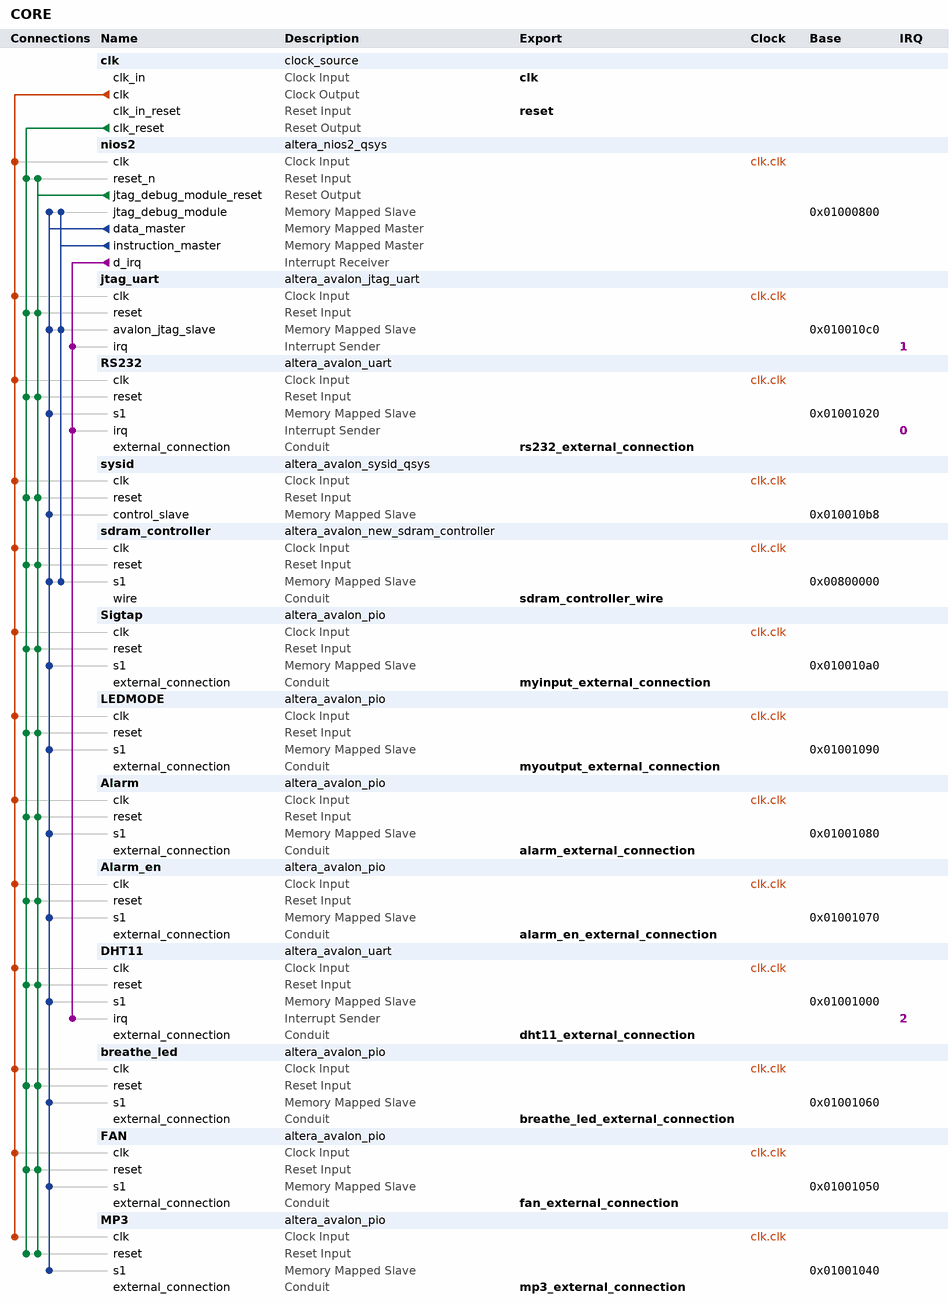
[diagram p0: system contents]
# Platform Designer (Qsys) system CORE, Cyclone II EP2C35F672C6
# Parameters at their usual value, and those the tool derives, are not listed.
package require -exact qsys 13.0.1
create_system CORE
set_project_property DEVICE_FAMILY {Cyclone II}
set_project_property DEVICE EP2C35F672C6

add_instance clk clock_source 13.0
set_instance_parameter_value clk clockFrequency 100000000

add_instance nios2 altera_nios2_qsys 13.0
set_instance_parameter_value nios2 resetSlave sdram_controller.s1
set_instance_parameter_value nios2 mmu_TLBMissExcSlave None
set_instance_parameter_value nios2 exceptionSlave sdram_controller.s1
set_instance_parameter_value nios2 breakSlave nios2.jtag_debug_module
set_instance_parameter_value nios2 impl Fast
set_instance_parameter_value nios2 icache_size 4096

add_instance jtag_uart altera_avalon_jtag_uart 13.0.1
set_instance_parameter_value jtag_uart simInteractiveOptions NO_INTERACTIVE_WINDOWS

add_instance RS232 altera_avalon_uart 13.0.1
set_instance_parameter_value RS232 baud 115200
set_instance_parameter_value RS232 dataBits 8
set_instance_parameter_value RS232 fixedBaud true
set_instance_parameter_value RS232 parity NONE
set_instance_parameter_value RS232 stopBits 1

add_instance sysid altera_avalon_sysid_qsys 13.0
set_instance_parameter_value sysid id 0

add_instance sdram_controller altera_avalon_new_sdram_controller 13.0.1
set_instance_parameter_value sdram_controller TAC 5.5
set_instance_parameter_value sdram_controller TRCD 20.0
set_instance_parameter_value sdram_controller TRP 20.0
set_instance_parameter_value sdram_controller casLatency 3
set_instance_parameter_value sdram_controller columnWidth 8
set_instance_parameter_value sdram_controller dataWidth 16
set_instance_parameter_value sdram_controller generateSimulationModel false
set_instance_parameter_value sdram_controller model single_Micron_MT48LC4M32B2_7_chip
set_instance_parameter_value sdram_controller numberOfBanks 4
set_instance_parameter_value sdram_controller numberOfChipSelects 1
set_instance_parameter_value sdram_controller powerUpDelay 100.0
set_instance_parameter_value sdram_controller refreshPeriod 15.625
set_instance_parameter_value sdram_controller rowWidth 12

add_instance Sigtap altera_avalon_pio 13.0.1
set_instance_parameter_value Sigtap direction Input
set_instance_parameter_value Sigtap width 1

add_instance LEDMODE altera_avalon_pio 13.0.1
set_instance_parameter_value LEDMODE direction Output
set_instance_parameter_value LEDMODE width 2

add_instance Alarm altera_avalon_pio 13.0.1
set_instance_parameter_value Alarm direction Input
set_instance_parameter_value Alarm width 1

add_instance Alarm_en altera_avalon_pio 13.0.1
set_instance_parameter_value Alarm_en direction Input
set_instance_parameter_value Alarm_en width 1

add_instance DHT11 altera_avalon_uart 13.0.1
set_instance_parameter_value DHT11 baud 115200
set_instance_parameter_value DHT11 dataBits 8
set_instance_parameter_value DHT11 fixedBaud true
set_instance_parameter_value DHT11 parity NONE
set_instance_parameter_value DHT11 stopBits 1

add_instance breathe_led altera_avalon_pio 13.0.1
set_instance_parameter_value breathe_led direction Output
set_instance_parameter_value breathe_led width 1

add_instance FAN altera_avalon_pio 13.0.1
set_instance_parameter_value FAN direction Output
set_instance_parameter_value FAN resetValue 1
set_instance_parameter_value FAN width 1

add_instance MP3 altera_avalon_pio 13.0.1
set_instance_parameter_value MP3 direction Output
set_instance_parameter_value MP3 resetValue 1
set_instance_parameter_value MP3 width 1

# connections
add_connection clk.clk Alarm.clk clock
add_connection clk.clk Alarm_en.clk clock
add_connection clk.clk breathe_led.clk clock
add_connection clk.clk DHT11.clk clock
add_connection clk.clk FAN.clk clock
add_connection clk.clk jtag_uart.clk clock
add_connection clk.clk LEDMODE.clk clock
add_connection clk.clk MP3.clk clock
add_connection clk.clk nios2.clk clock
add_connection clk.clk RS232.clk clock
add_connection clk.clk sdram_controller.clk clock
add_connection clk.clk Sigtap.clk clock
add_connection clk.clk sysid.clk clock
add_connection clk.clk_reset Alarm.reset reset
add_connection clk.clk_reset Alarm_en.reset reset
add_connection clk.clk_reset breathe_led.reset reset
add_connection clk.clk_reset DHT11.reset reset
add_connection clk.clk_reset FAN.reset reset
add_connection clk.clk_reset jtag_uart.reset reset
add_connection clk.clk_reset LEDMODE.reset reset
add_connection clk.clk_reset MP3.reset reset
add_connection clk.clk_reset nios2.reset_n reset
add_connection clk.clk_reset RS232.reset reset
add_connection clk.clk_reset sdram_controller.reset reset
add_connection clk.clk_reset Sigtap.reset reset
add_connection clk.clk_reset sysid.reset reset
add_connection nios2.jtag_debug_module_reset Alarm.reset reset
add_connection nios2.jtag_debug_module_reset Alarm_en.reset reset
add_connection nios2.jtag_debug_module_reset breathe_led.reset reset
add_connection nios2.jtag_debug_module_reset DHT11.reset reset
add_connection nios2.jtag_debug_module_reset FAN.reset reset
add_connection nios2.jtag_debug_module_reset jtag_uart.reset reset
add_connection nios2.jtag_debug_module_reset LEDMODE.reset reset
add_connection nios2.jtag_debug_module_reset MP3.reset reset
add_connection nios2.jtag_debug_module_reset nios2.reset_n reset
add_connection nios2.jtag_debug_module_reset RS232.reset reset
add_connection nios2.jtag_debug_module_reset sdram_controller.reset reset
add_connection nios2.jtag_debug_module_reset Sigtap.reset reset
add_connection nios2.jtag_debug_module_reset sysid.reset reset
add_connection nios2.data_master Alarm.s1 avalon
set_connection_parameter_value nios2.data_master/Alarm.s1 baseAddress 0x01001080
add_connection nios2.data_master Alarm_en.s1 avalon
set_connection_parameter_value nios2.data_master/Alarm_en.s1 baseAddress 0x01001070
add_connection nios2.data_master breathe_led.s1 avalon
set_connection_parameter_value nios2.data_master/breathe_led.s1 baseAddress 0x01001060
add_connection nios2.data_master DHT11.s1 avalon
set_connection_parameter_value nios2.data_master/DHT11.s1 baseAddress 0x01001000
add_connection nios2.data_master FAN.s1 avalon
set_connection_parameter_value nios2.data_master/FAN.s1 baseAddress 0x01001050
add_connection nios2.data_master jtag_uart.avalon_jtag_slave avalon
set_connection_parameter_value nios2.data_master/jtag_uart.avalon_jtag_slave baseAddress 0x010010c0
add_connection nios2.data_master LEDMODE.s1 avalon
set_connection_parameter_value nios2.data_master/LEDMODE.s1 baseAddress 0x01001090
add_connection nios2.data_master MP3.s1 avalon
set_connection_parameter_value nios2.data_master/MP3.s1 baseAddress 0x01001040
add_connection nios2.data_master nios2.jtag_debug_module avalon
set_connection_parameter_value nios2.data_master/nios2.jtag_debug_module baseAddress 0x01000800
add_connection nios2.data_master RS232.s1 avalon
set_connection_parameter_value nios2.data_master/RS232.s1 baseAddress 0x01001020
add_connection nios2.data_master sdram_controller.s1 avalon
set_connection_parameter_value nios2.data_master/sdram_controller.s1 baseAddress 0x00800000
add_connection nios2.data_master Sigtap.s1 avalon
set_connection_parameter_value nios2.data_master/Sigtap.s1 baseAddress 0x010010a0
add_connection nios2.data_master sysid.control_slave avalon
set_connection_parameter_value nios2.data_master/sysid.control_slave baseAddress 0x010010b8
add_connection nios2.instruction_master jtag_uart.avalon_jtag_slave avalon
set_connection_parameter_value nios2.instruction_master/jtag_uart.avalon_jtag_slave baseAddress 0x010010c0
add_connection nios2.instruction_master nios2.jtag_debug_module avalon
set_connection_parameter_value nios2.instruction_master/nios2.jtag_debug_module baseAddress 0x01000800
add_connection nios2.instruction_master sdram_controller.s1 avalon
set_connection_parameter_value nios2.instruction_master/sdram_controller.s1 baseAddress 0x00800000
add_connection nios2.d_irq DHT11.irq interrupt
set_connection_parameter_value nios2.d_irq/DHT11.irq irqNumber 2
add_connection nios2.d_irq jtag_uart.irq interrupt
set_connection_parameter_value nios2.d_irq/jtag_uart.irq irqNumber 1
add_connection nios2.d_irq RS232.irq interrupt
set_connection_parameter_value nios2.d_irq/RS232.irq irqNumber 0

# exported interfaces
add_interface clk clock sink
set_interface_property clk EXPORT_OF clk.clk_in
add_interface reset reset sink
set_interface_property reset EXPORT_OF clk.clk_in_reset
add_interface rs232_external_connection conduit end
set_interface_property rs232_external_connection EXPORT_OF RS232.external_connection
add_interface sdram_controller_wire conduit end
set_interface_property sdram_controller_wire EXPORT_OF sdram_controller.wire
add_interface myoutput_external_connection conduit end
set_interface_property myoutput_external_connection EXPORT_OF LEDMODE.external_connection
add_interface myinput_external_connection conduit end
set_interface_property myinput_external_connection EXPORT_OF Sigtap.external_connection
add_interface alarm_external_connection conduit end
set_interface_property alarm_external_connection EXPORT_OF Alarm.external_connection
add_interface alarm_en_external_connection conduit end
set_interface_property alarm_en_external_connection EXPORT_OF Alarm_en.external_connection
add_interface dht11_external_connection conduit end
set_interface_property dht11_external_connection EXPORT_OF DHT11.external_connection
add_interface breathe_led_external_connection conduit end
set_interface_property breathe_led_external_connection EXPORT_OF breathe_led.external_connection
add_interface fan_external_connection conduit end
set_interface_property fan_external_connection EXPORT_OF FAN.external_connection
add_interface mp3_external_connection conduit end
set_interface_property mp3_external_connection EXPORT_OF MP3.external_connection

set_interconnect_requirement {$system} qsys_mm.clockCrossingAdapter HANDSHAKE
set_interconnect_requirement {$system} qsys_mm.maxAdditionalLatency 1

save_system CORE.qsys
